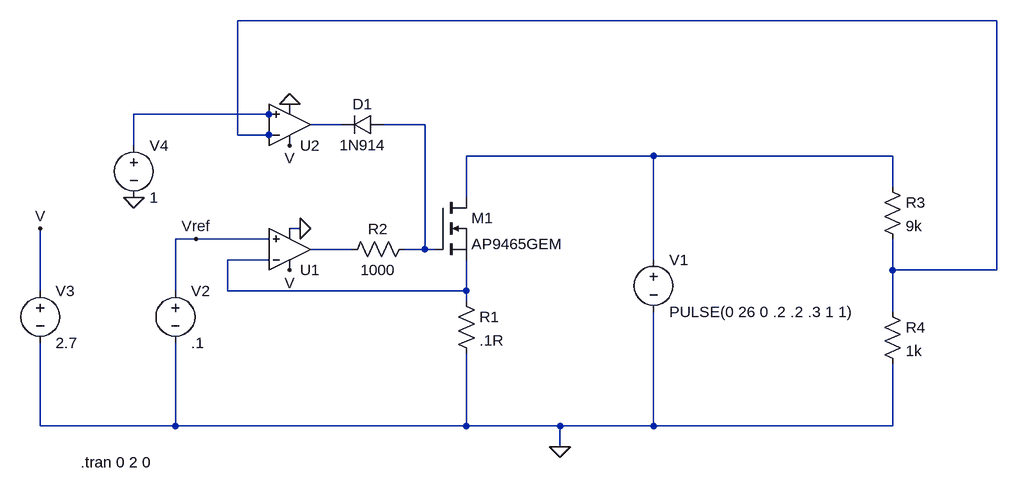
[diagram p0: schematic csos.asc]
csos.asc, the LTspice schematic file:
Version 4
SHEET 1 1220 680
WIRE 1216 -384 48 -384
WIRE 96 -240 -112 -240
WIRE 112 -240 96 -240
WIRE 208 -224 160 -224
WIRE 336 -224 272 -224
WIRE 48 -208 48 -384
WIRE 96 -208 48 -208
WIRE 112 -208 96 -208
WIRE -112 -192 -112 -240
WIRE 688 -176 400 -176
WIRE 1056 -176 688 -176
WIRE 1056 -128 1056 -176
WIRE 400 -112 400 -176
WIRE 144 -64 128 -64
WIRE -16 -48 -48 -48
WIRE 96 -48 -16 -48
WIRE 224 -32 160 -32
WIRE 336 -32 336 -224
WIRE 336 -32 304 -32
WIRE 352 -32 336 -32
WIRE 96 -16 32 -16
WIRE 688 -16 688 -176
WIRE 1056 0 1056 -48
WIRE 1216 0 1216 -384
WIRE 1216 0 1056 0
WIRE -256 32 -256 -64
WIRE -48 32 -48 -48
WIRE 32 32 32 -16
WIRE 400 32 400 -16
WIRE 400 32 32 32
WIRE 400 48 400 32
WIRE 1056 64 1056 0
WIRE -256 240 -256 112
WIRE -48 240 -48 112
WIRE -48 240 -256 240
WIRE 400 240 400 128
WIRE 400 240 -48 240
WIRE 544 240 400 240
WIRE 688 240 688 64
WIRE 688 240 544 240
WIRE 1056 240 1056 144
WIRE 1056 240 688 240
WIRE 544 272 544 240
FLAG 544 272 0
FLAG -256 -64 V
FLAG 128 0 V
FLAG 144 -64 0
FLAG -16 -48 Vref
FLAG 128 -192 V
FLAG 128 -256 0
FLAG -112 -112 0
SYMBOL voltage 688 -32 R0
WINDOW 123 0 0 Left 2
WINDOW 39 0 0 Left 2
SYMATTR InstName V1
SYMATTR Value PULSE(0 26 0 .2 .2 .3 1 1)
SYMBOL res 384 32 R0
SYMATTR InstName R1
SYMATTR Value .1R
SYMBOL voltage -48 16 R0
WINDOW 123 0 0 Left 2
WINDOW 39 0 0 Left 2
SYMATTR InstName V2
SYMATTR Value .1
SYMBOL voltage -256 16 R0
WINDOW 123 0 0 Left 2
WINDOW 39 0 0 Left 2
SYMATTR InstName V3
SYMATTR Value 2.7
SYMBOL nmos 352 -112 R0
SYMATTR InstName M1
SYMATTR Value AP9465GEM
SYMBOL res 320 -48 R90
WINDOW 0 0 56 VBottom 2
WINDOW 3 32 56 VTop 2
SYMATTR InstName R2
SYMATTR Value 1000
SYMBOL diode 272 -240 R90
WINDOW 0 0 32 VBottom 2
WINDOW 3 32 32 VTop 2
SYMATTR InstName D1
SYMATTR Value 1N914
SYMBOL res 1040 -144 R0
SYMATTR InstName R3
SYMATTR Value 9k
SYMBOL res 1040 48 R0
SYMATTR InstName R4
SYMATTR Value 1k
SYMBOL voltage -112 -208 R0
WINDOW 123 0 0 Left 2
WINDOW 39 0 0 Left 2
SYMATTR InstName V4
SYMATTR Value 1
SYMBOL Opamps\\UniversalOpamp2 128 -224 M180
SYMATTR InstName U2
SYMBOL Opamps\\UniversalOpamp2 128 -32 M180
SYMATTR InstName U1
TEXT -194 296 Left 2 !.tran 0 2 0

The netlist it stands for:
* csos.asc
V1 N005 0 PULSE(0 26 0 .2 .2 .3 1 1)
R1 N007 0 .1R
V2 Vref 0 .1
V3 V 0 2.7
M1 N005 N004 N007 N007 AP9465GEM
R2 N004 N006 1000
D1 N004 N003 1N914
R3 N005 N001 9k
R4 N001 0 1k
V4 N002 0 1
XU2 N002 N001 V 0 N003 level.2 Avol=1Meg GBW=10Meg Slew=10Meg ilimit=25m rail=0 Vos=0 phimargin=45 en=0 enk=0 in=0 ink=0 Rin=500Meg  ; pins IN+ IN- V+ V- OUT
XU1 Vref N007 V 0 N006 level.2 Avol=1Meg GBW=10Meg Slew=10Meg ilimit=25m rail=0 Vos=0 phimargin=45 en=0 enk=0 in=0 ink=0 Rin=500Meg  ; pins IN+ IN- V+ V- OUT
.model D D
.lib standard.dio
.model NMOS NMOS
.model PMOS PMOS
.lib standard.mos
.tran 0 2 0
.lib UniversalOpamps2.sub
.backanno
.end